# EAGLE design SOT23-8-minimal (EAGLE 6.5.0)
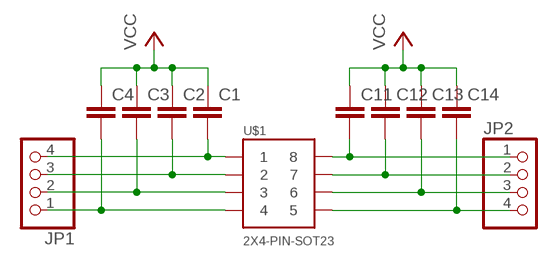
[diagram p0: schematic, sheet 1]

## Parts
C1  C-EUC0603  [C0603]
C2  C-EUC0603  [C0603]
C3  C-EUC0603  [C0603]
C4  C-EUC0603  [C0603]
C11  C-EUC0603  [C0603]
C12  C-EUC0603  [C0603]
C13  C-EUC0603  [C0603]
C14  C-EUC0603  [C0603]
JP1  PINHD-1X4  [1X04]
JP2  PINHD-1X4  [1X04]
U$1  2X4-PIN-SOT23  [SOT23-8]

## Nets
1: C1.2 JP1.4 U$1.P$1
2: C2.2 JP1.3 U$1.P$2
3: C3.2 JP1.2 U$1.P$3
4: C4.2 JP1.1 U$1.P$4
5: C14.2 JP2.4 U$1.P$5
6: C13.2 JP2.3 U$1.P$6
7: C12.2 JP2.2 U$1.P$7
8: C11.2 JP2.1 U$1.P$8
VCC: C1.1 C2.1 C3.1 C4.1 C11.1 C12.1 C13.1 C14.1

## Library data of the parts
C1-C4 C11-C14 = p.peter-rcl:C-EU: CAPACITOR, European symbol
JP1 JP2 = pinhead:PINHD-1X4: PIN HEADER
U$1 = p.peter-pacakages:2X4-PIN

## Board
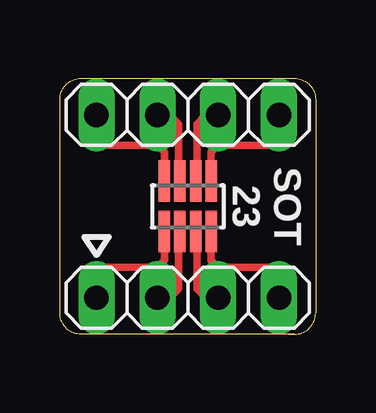
[diagram p1: board, top side]
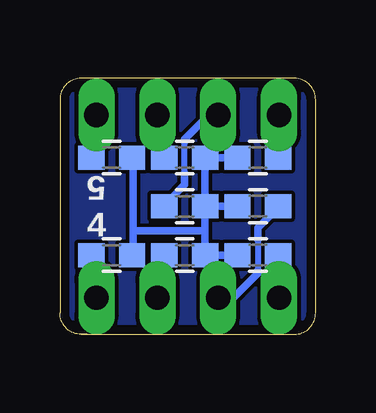
[diagram p2: board, bottom side, seen from below]

Size 10.67 x 10.67 mm. Coordinates in mm from the lower left corner, seen from the top.
Outline: 0,0.89 0,1.02
Outline: 0,1.02 0,9.78 arc-90 0.89,10.67
Outline: 0.89,10.67 1.02,10.67
Outline: 1.02,10.67 9.78,10.67 arc-90 10.67,9.78 10.67,0.89 arc-90 9.78,0
Outline: 9.78,0 9.53,0
Outline: 9.53,0 1.14,0
Outline: 1.14,0 0.89,0
Outline: 0.89,10.67 1.02,10.67
Outline: 9.53,0 9.78,0
Outline: 1.14,0 0.89,0
Outline: 0.89,0 arc-90 0,0.89
Outline: 0,0.89 0,1.02
Copper layers (1*16): Top 0.0356mm / dielectric 1.5011mm / Bottom 0.0356mm
Design rules "oshpark": minimum track width 6mil, minimum drill 13mil, track to track 6mil, track to pad 6mil, pad to pad 6mil, via to via 6mil, smd to smd 6mil, copper to edge 15mil, drill to drill 6mil, minimum pad ring 7mil, minimum via ring 7mil, stop-mask expansion 4mil, vias tented up to drill 4.1mm, thermal gap 10mil

### Footprints (pad centres in the part's own frame; a part is rotated, then mirrored left to right if it is on the bottom)
C0603 = smd 1.1 x 1: 1 -0.85,0; 2 0.85,0
1X04 = drill 1.016 long: 1 -3.81,0; 2 -1.27,0; 3 1.27,0; 4 3.81,0
SOT23-8 = smd 0.48 x 1.725: P$1 -0.975,-1.05; P$2 -0.325,-1.05; P$3 0.325,-1.05; P$4 0.975,-1.05; P$5 0.975,1.05; P$6 0.325,1.05; P$7 -0.325,1.05; P$8 -0.975,1.05

### Placement (x,y rotation side)
C1  2.41,3.3 0 bottom
C2  2.41,5.33 0 bottom
C3  5.46,3.3 180 bottom
C4  8.51,3.3 180 bottom
C11  2.41,7.37 0 bottom
C12  5.46,5.33 180 bottom
C13  5.46,7.37 180 bottom
C14  8.51,7.37 180 bottom
JP1  5.33,1.52 180 top
JP2  5.33,9.14 0 top
U$1  5.33,5.33 0 top

### Tracks (layer width: path | path; a pad name or v marks a point on that pad's centre or on a via)
1
  Top 0.305: U$1.P$1 4.36,3.09 4.06,2.79 1.78,2.79 1.52,2.54 JP1.4
  Bottom 0.305: C1.2 1.52,3.3 JP1.4
2
  Top 0.305: U$1.P$2 5.01,3.74 4.95,3.68 4.95,1.91 4.57,1.52 JP1.3
  Bottom 0.254: 2.41,3.94 2.41,2.67
  Bottom 0.305: C2.2 1.56,5.29 2.41,4.44 2.41,3.94 | 2.41,2.67 2.41,2.54 3.43,1.52 JP1.3
3
  Top 0.305: U$1.P$3 5.66,3.74 5.72,3.68 5.72,1.91 6.1,1.52 JP1.2
  Bottom 0.305: C3.2 6.6,3.3 JP1.2
4
  Top 0.305: U$1.P$4 6.31,3.09 6.6,2.79 8.89,2.79 9.14,2.54 JP1.1
  Bottom 0.305: C4.2 9.14,3.3 JP1.1
5
  Top 0.305: U$1.P$5 6.31,7.58 6.6,7.87 8.89,7.87 9.14,8.13 JP2.4
  Bottom 0.305: C14.2 9.27,7.37 9.14,7.49 JP2.4
6
  Top 0.305: U$1.P$6 5.66,6.93 5.72,6.99 5.72,8.76 6.1,9.14 JP2.3
  Bottom 0.305: C13.2 6.6,7.37 6.6,7.62 JP2.3
7
  Top 0.305: U$1.P$7 4.95,6.38 4.95,7.11 4.95,8.76 4.57,9.14 JP2.2
  Bottom 0.254: 5.46,6.73 5.46,8
  Bottom 0.305: 6.31,5.5 C12.2 6.1,5.55 6.1,5.59 5.46,6.22 5.46,6.73 | 5.46,8 5.46,8.13 4.45,9.14 JP2.2
8
  Top 0.305: U$1.P$8 4.36,7.58 4.06,7.87 1.78,7.87 1.52,8.13 JP2.1
  Bottom 0.305: C11.2 1.52,7.37 JP2.1
GND
  pour Bottom (isolate 0.152): 0,0 10.67,0 10.67,10.67 0,10.67
VCC
  Bottom 0.305: C2.1 C12.1 | C11.1 C13.1 C12.1 | C1.1 3.94,3.3 C3.1 4.61,4.32 | 4.61,4.32 C12.1 | C4.1 7.62,3.3 7.62,4.32 | 7.62,4.32 7.62,4.57 | 7.62,4.57 7.62,7.33 | 7.62,7.33 C14.1 | 7.62,7.33 7.62,4.57 | 7.62,4.57 7.62,4.32 | 7.62,4.32 4.61,4.32

### Text on the board
tPlace: SOT / 23
bPlace: 5 | 4